# Altium schematic sheet 13 APPENDIX JUMPER_DNP.SchDoc
size 513 x 386 mm
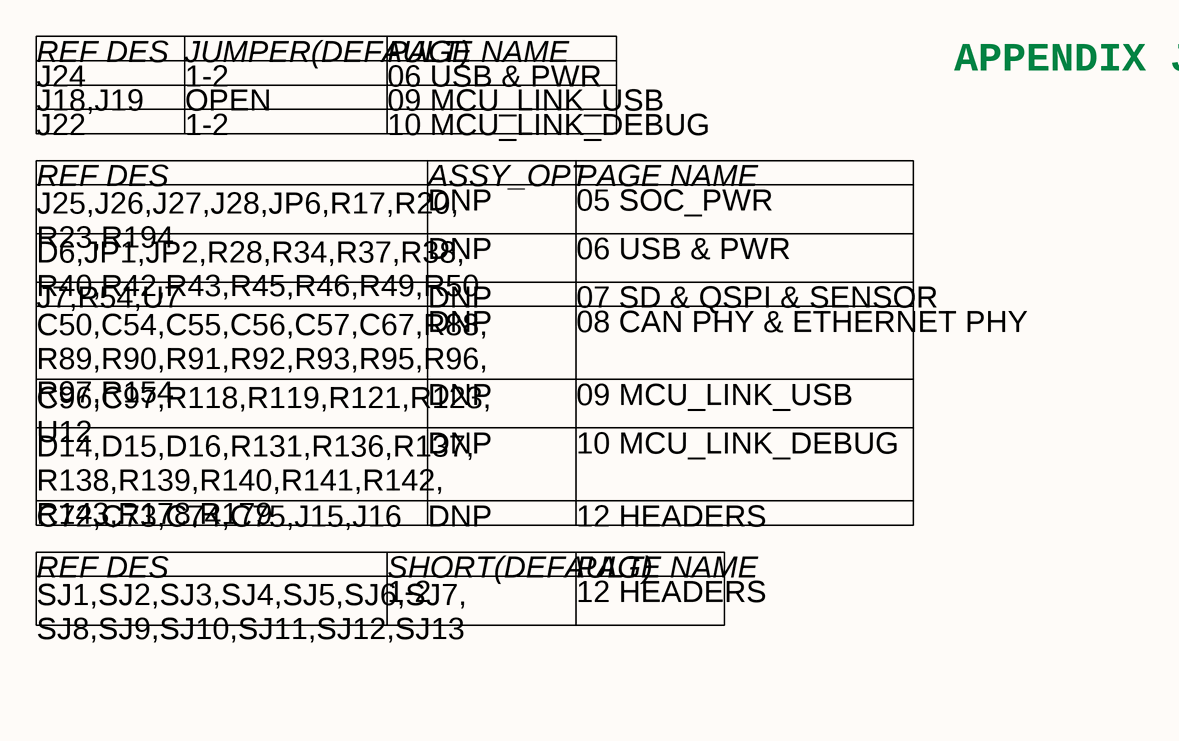
[diagram p0: 13 APPENDIX JUMPER_DNP.SchDoc, left]
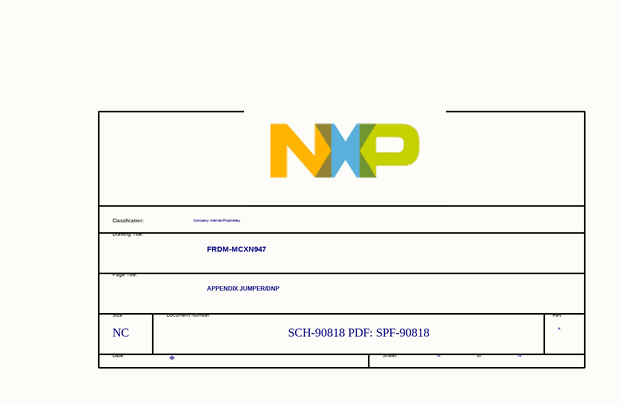
[diagram p1: 13 APPENDIX JUMPER_DNP.SchDoc, right]

## Parts
*  Doc: SCH-90818 PDF: SPF-90818  RevCode: A  Title: FRDM-MCXN947  Page Size: NC  Page Number: 13  PageTitle: APPENDIX JUMPER/DNP  Classification: Company Internal/Proprietary  (hidden comment: TitleBlock_FS)  (graphical)

## Notes on the sheet
- REF DES
- J24
- J18,J19
- JUMPER(DEFAULT)
- 1-2
- OPEN
- PAGE NAME
- 06 USB & PWR
- 09 MCU_LINK_USB
- APPENDIX JUMPER/DNP
- J22
- J25,J26,J27,J28,JP6,R17,R20,
  R23,R194
- 10 MCU_LINK_DEBUG
- D6,JP1,JP2,R28,R34,R37,R38,
  R40,R42,R43,R45,R46,R49,R50
- ASSY_OPT
- DNP
- 05 SOC_PWR
- J7,R54,U7
- C50,C54,C55,C56,C57,C67,R88,
  R89,R90,R91,R92,R93,R95,R96,
  R97,R154
- 07 SD & QSPI & SENSOR
- C96,C97,R118,R119,R121,R123,
  U12
- 08 CAN PHY & ETHERNET PHY
- D14,D15,D16,R131,R136,R137,
  R138,R139,R140,R141,R142,
  R143,R178,R179
- C72,C73,C74,C75,J15,J16
- SJ1,SJ2,SJ3,SJ4,SJ5,SJ6,SJ7,
  SJ8,SJ9,SJ10,SJ11,SJ12,SJ13
- SHORT(DEFAULT)
- 12 HEADERS
- (in symbol TitleBlock_FS) Classification:; Drawing Title:; Page Title:; Size; Document Number; Rev; Date:; Sheet; of

## Library data of the parts
* = TitleBlock_FS: Classification: Public, Company Internal/Proprietary, Company Confidential,  Company Secret; Variant Name: <Core Design>; OrgAddr2: Austin, TX 78735-8598; OrgAddr1: 6501 William Cannon Drive West; OrgName: NXP Semiconductors; Page Create Date: March  8, 1995; Page Count: 13; Page Modify Date: *